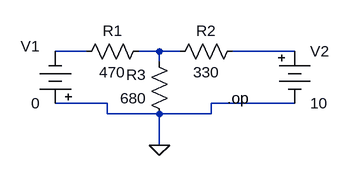
[diagram p0: schematic Super_02.asc]
Super_02.asc, the LTspice schematic file:
Version 4
SHEET 1 880 680
WIRE 64 128 16 128
WIRE 176 128 144 128
WIRE 208 128 176 128
WIRE 384 128 288 128
WIRE 176 144 176 128
WIRE 96 208 16 208
WIRE 384 208 256 208
WIRE 96 224 96 208
WIRE 176 224 96 224
WIRE 256 224 256 208
WIRE 256 224 176 224
WIRE 176 272 176 224
FLAG 176 272 0
DATAFLAG 176 144 ""
SYMBOL Misc\\battery 16 224 R180
WINDOW 0 24 104 Left 2
WINDOW 3 24 16 Left 2
SYMATTR InstName V1
SYMATTR Value 0
SYMBOL Misc\\battery 384 112 R0
SYMATTR InstName V2
SYMATTR Value 10
SYMBOL res 160 112 R90
WINDOW 0 0 56 VBottom 2
WINDOW 3 32 56 VTop 2
SYMATTR InstName R1
SYMATTR Value 470
SYMBOL res 304 112 R90
WINDOW 0 0 56 VBottom 2
WINDOW 3 32 56 VTop 2
SYMATTR InstName R2
SYMATTR Value 330
SYMBOL res 192 240 R180
WINDOW 0 36 76 Left 2
WINDOW 3 36 40 Left 2
SYMATTR InstName R3
SYMATTR Value 680
TEXT 280 200 Left 2 !.op

The netlist it stands for:
* Super_02.asc
V1 0 N001 0
V2 N003 0 10
R1 N002 N001 470
R2 N003 N002 330
R3 0 N002 680
.op
.backanno
.end